# Altium project ESPress_Yourself.PrjPcb
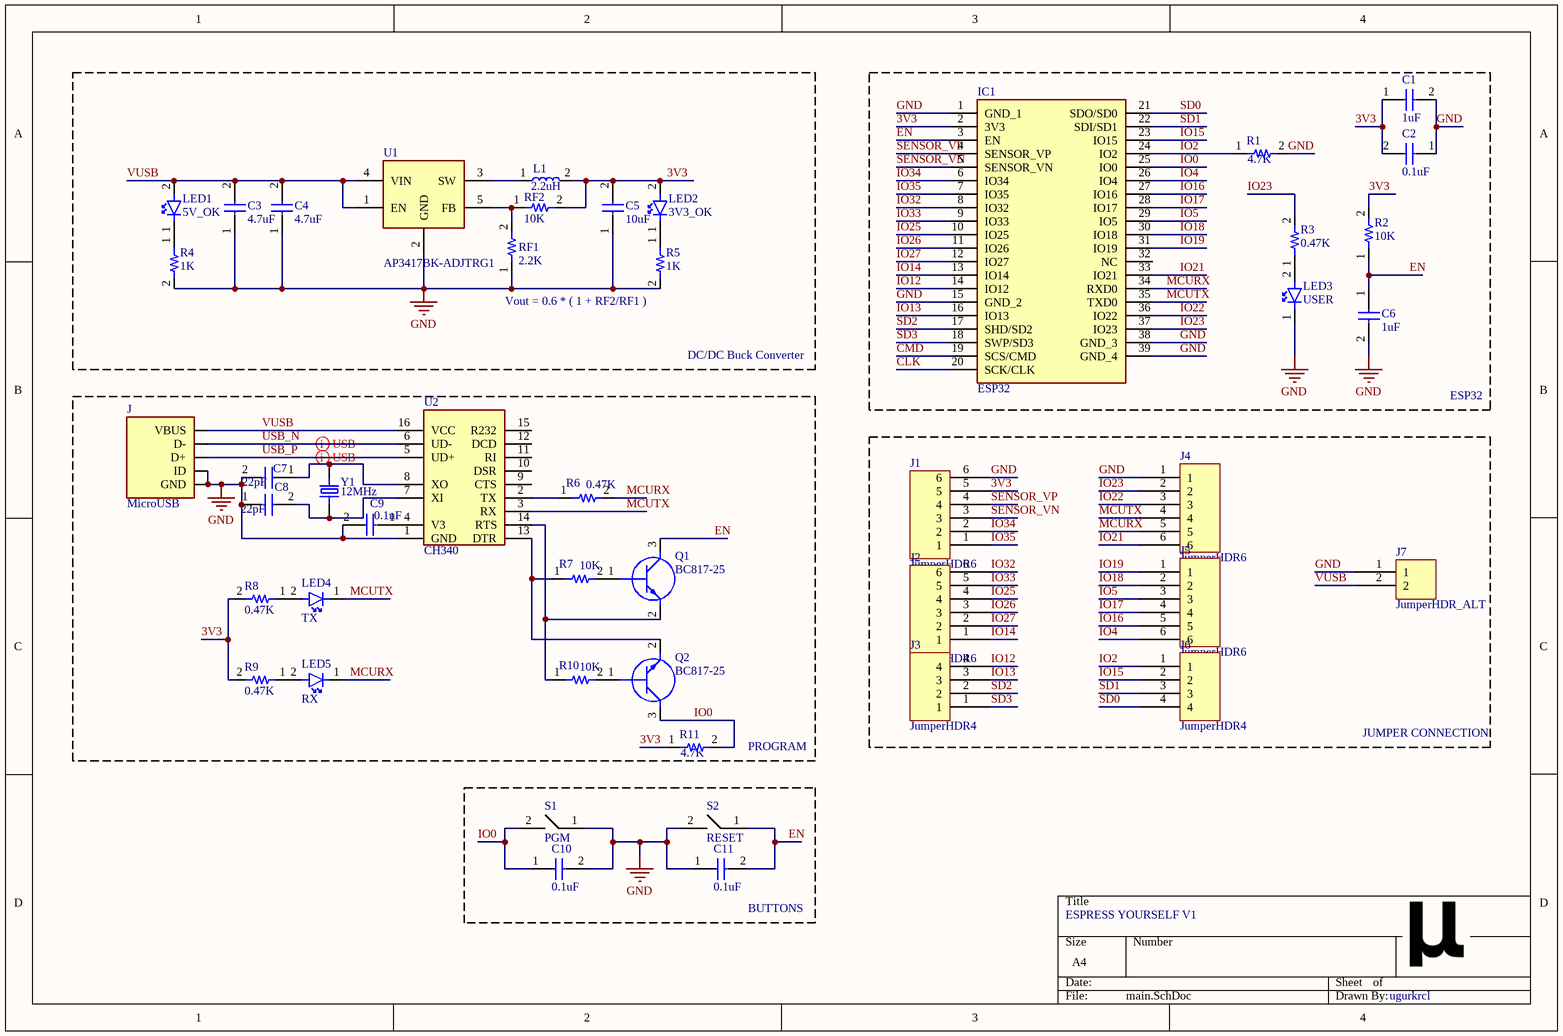
[diagram p0: main.SchDoc]
1 sheet, 46 parts. Net scope: global (net labels, ports and power ports of the same name join across sheets).
Board file: PCB1.PcbDoc

## Sheet main.SchDoc
size A4; SheetNumber: 1; SheetTotal: 1

### Parts
C1  1uF  [0805 Capacitor]
C2  0.1uF  [0603 Capacitor]
C3  4.7uF  [0805 Capacitor]
C4  4.7uF  [0805 Capacitor]
C5  10uF  [0805 Capacitor]
C6  1uF  [0603 Capacitor]
C7  22pF  [0603 Capacitor]
C8  22pF  [0603 Capacitor]
C9  0.1uF  [0603 Capacitor]
C10  0.1uF  [0603 Capacitor]
C11  0.1uF  [0603 Capacitor]
IC1  ESP32  [ESP32]
J  MicroUSB  [MicroUSB]
J1  JumperHDR6  [JumperHDR6]
J2  JumperHDR6  [JumperHDR6]
J3  JumperHDR4  [JumperHDR4]
J4  JumperHDR6  [JumperHDR6]
J5  JumperHDR6  [JumperHDR6]
J6  JumperHDR4  [JumperHDR4]
J7  JumperHDR_ALT  [JumperHDR]
L1  2.2uH  [INDUCTOR_3x3.5]
LED1  5V_OK  [0603 LED]
LED2  3V3_OK  [0603 LED]
LED3  USER  [0603 LED]
LED4  TX  [0603 LED]
LED5  RX  [0603 LED]
Q1  BC817-25  [BC817]
Q2  BC817-25  [BC817]
R1  4.7K  [0603 Resistor]
R2  10K  [0603 Resistor]
R3  0.47K  [0603 Resistor]
R4  1K  [0603 Resistor]
R5  1K  [0603 Resistor]
R6  0.47K  [0603 Resistor]
R7  10K  [0603 Resistor]
R8  0.47K  [0603 Resistor]
R9  0.47K  [0603 Resistor]
R10  10K  [0603 Resistor]
R11  4.7K  [0603 Resistor]
RF1  2.2K  [0603 Resistor]
RF2  10K  [0603 Resistor]
S1  PGM  [TACT SWITCH SMD]
S2  RESET  [TACT SWITCH SMD]
U1  AP3417BK-ADJTRG1  [SOT BUCK]
U2  CH340  [ch340g-SOIC16]
Y1  value 12MHz  [Crystal-HC49]  (hidden comment: HC49 Crystal)

### Blocks framed on the sheet
ESP32: C1 C2 C6 IC1 LED3 R1-R3
PROGRAM: C7-C9 J LED4 LED5 Q1 Q2 R6-R11 U2 Y1
JUMPER CONNECTION: J1-J7
BUTTONS: C10 C11 S1 S2

### Nets
GND: C1.2 C2.1 C3.1 C4.1 C5.1 C6.2 C7.2 C8.1 C9.2 C10.2 C11.1 IC1.1(GND_1) IC1.15(GND_2) IC1.38(GND_3) IC1.39(GND_4) J.4(ID) J.5(GND) J1.6 J4.1 J7.1 LED3.1(K) R1.2 R4.2 R5.2 RF1.1 S1.1 S2.2 U1.2(GND) U2.1(GND)
3V3: C1.1 C2.2 C5.2 IC1.2(3V3) J1.5 L1.2 LED2.2(A) R2.2 R8.2 R9.2 R11.1 RF2.2
CLK: IC1.20(SCK/CLK)
CMD: IC1.19(SCS/CMD)
EN: C6.1 C11.2 IC1.3(EN) Q1.3(C) R2.1 S2.1
IO0: C10.1 IC1.25(IO0) Q2.3(C) R11.2 S1.2
IO2: IC1.24(IO2) J6.1 R1.1
IO4: IC1.26(IO4) J5.6
IO5: IC1.29(IO5) J5.3
IO12: IC1.14(IO12) J3.4
IO13: IC1.16(IO13) J3.3
IO14: IC1.13(IO14) J2.1
IO15: IC1.23(IO15) J6.2
IO16: IC1.27(IO16) J5.5
IO17: IC1.28(IO17) J5.4
IO18: IC1.30(IO18) J5.2
IO19: IC1.31(IO19) J5.1
IO21: IC1.33(IO21) J4.6
IO22: IC1.36(IO22) J4.3
IO23: IC1.37(IO23) J4.2 R3.2
IO25: IC1.10(IO25) J2.4
IO26: IC1.11(IO26) J2.3
IO27: IC1.12(IO27) J2.2
IO32: IC1.8(IO32) J2.6
IO33: IC1.9(IO33) J2.5
IO34: IC1.6(IO34) J1.2
IO35: IC1.7(IO35) J1.1
MCURX: IC1.34(RXD0) J4.5 LED5.1(K) R6.2
MCUTX: IC1.35(TXD0) J4.4 LED4.1(K) U2.3(RX)
SD0: IC1.21(SDO/SD0) J6.4
SD1: IC1.22(SDI/SD1) J6.3
SD2: IC1.17(SHD/SD2) J3.2
SD3: IC1.18(SWP/SD3) J3.1
SENSOR_VN: IC1.5(SENSOR_VN) J1.3
SENSOR_VP: IC1.4(SENSOR_VP) J1.4
USB_N: J.2(D-) U2.6(UD-)
USB_P: J.3(D+) U2.5(UD+)
VUSB: C3.2 C4.2 J.1(VBUS) J7.2 LED1.2(A) U1.1(EN) U1.4(VIN) U2.16(VCC)
NetC7_1: C7.1 U2.8(XO) Y1.2
NetC8_2: C8.2 U2.7(XI) Y1.1
NetC9_1: C9.1 U2.4(V3)
NetL1_1: L1.1 U1.3(SW)
NetLED1_1: LED1.1(K) R4.1
NetLED2_1: LED2.1(K) R5.1
NetLED3_2: LED3.2(A) R3.1
NetLED4_2: LED4.2(A) R8.1
NetLED5_2: LED5.2(A) R9.1
NetQ1_1: Q1.1(B) R7.2
NetQ1_2: Q1.2(E) R10.1 U2.14(RTS)
NetQ2_1: Q2.1(B) R10.2
NetQ2_2: Q2.2(E) R7.1 U2.13(DTR)
NetR6_1: R6.1 U2.2(TX)
NetRF1_2: RF1.2 RF2.1 U1.5(FB)

Not connected (* = marked no-connect by the designer): IC1 32(NC); U2 9(CTS) 10(DSR) 11(RI) 12(DCD) 15(R232)

### Layout directives
differential pair: USB_N, USB_P

### Notes on the sheet
- Vout = 0.6 * ( 1 + RF2/RF1 )
- DC/DC Buck Converter
- ESPRESS YOURSELF V1
- ugurkrcl

### Library data of the parts
C1 C3-C5 = 0805 Capacitor: Capacitor; Manufacturer_Name: TDK; Manufacturer_Part_Number: C3216C0G1H682J060AA; Datasheet Link: https://product.tdk.com/info/en/catalog/datasheets/mlcc_commercial_midvoltage_en.pdf; Height: 0.75mm; Mouser Part Number: 810-C3216C0G1H682J-1; Mouser Price/Stock: https://www.mouser.com/Search/Refine.aspx?Keyword=810-C3216C0G1H682J-1
C2 C6-C11 = 0603 Capacitor: Capacitor; Manufacturer_Name: AVX; Manufacturer_Part_Number: 06031A120JAT2A; Datasheet Link: http://www.mouser.com/catalog/supplier/library/pdf/AVXSurfaceMountCeramic.pdf; Height: 0.9mm; Mouser Part Number: 581-06031A120J; Mouser Price/Stock: https://www.mouser.co.uk/ProductDetail/AVX/06031A120JAT2A?qs=tMrmimOZp5UsY%252BxF6dNGxQ%3D%3D; Arrow Part Number: 06031A120JAT2A; Arrow Price/Stock: https://www.arrow.com/en/products/06031a120jat2a/avx
IC1 = ESP32: Integrated Circuit; Manufacturer_Name: Espressif Systems; Manufacturer_Part_Number: ESP-WROOM-32D; Datasheet Link: https://componentsearchengine.com/Datasheets/1/ESP-WROOM-32D.pdf; Height: 3.2mm; Mouser Part Number: 356-ESP-WROOM-32D; Mouser Price/Stock: https://www.mouser.co.uk/ProductDetail/Espressif-Systems/ESP-WROOM-32D?qs=MLItCLRbWsyWVKgdQMcFuQ%3D%3D
J = MicroUSB: MP: ZX62-B-5PA; MF: Hirose; Value: *; Price: None; SnapEDA_Link: https://www.snapeda.com/parts/ZX62-B-5PA/Hirose%20Electric%20Co%20Ltd/view-part/134668/?ref=snap; Availability: Unavailable; Package: None
L1 = INDUCTOR_3x3.5: Inductor; Manufacturer_Name: Shuo Xing; Manufacturer_Part_Number: CD32-4R7M; Datasheet Link: http://aitendo3.sakura.ne.jp/aitendo_data/product_img/parts/coil/CD32/CD32.pdf; Height: 2.4mm
LED1-LED5 = 0603 LED: LED; Manufacturer_Name: Wurth Elektronik; Manufacturer_Part_Number: 150060GS55040; Datasheet Link: https://katalog.we-online.de/led/datasheet/150060GS55040.pdf; Height: 0.5mm; Mouser Part Number: 710-150060GS55040; Mouser Price/Stock: https://www.mouser.com/Search/Refine.aspx?Keyword=710-150060GS55040
Q1 Q2 = BC817-25: Transistor BJT NPN; Manufacturer_Name: Nexperia; Datasheet Link: https://assets.nexperia.com/documents/data-sheet/BC817_BC817W_BC337.pdf; Height: 1.1mm; Manufacturer_Part_Number: BC817-25; Mouser Part Number: N/A; Mouser Price/Stock: https://www.mouser.com/Search/Refine.aspx?Keyword=N%2FA
R1-R11 RF1 RF2 = 0603 Resistor: Resistor; Manufacturer_Name: TE Connectivity; Manufacturer_Part_Number: CPF0603B100RE1; Datasheet Link: http://www.farnell.com/datasheets/1786775.pdf; Height: 0.55mm; Mouser Part Number: 279-CPF0603B100RE1; Mouser Price/Stock: https://www.mouser.co.uk/ProductDetail/TE-Connectivity-Neohm/CPF0603B100RE1?qs=DfH2yQaBz6s2KWheq2AlNw%3D%3D; Arrow Part Number: CPF0603B100RE1; Arrow Price/Stock: https://www.arrow.com/en/products/cpf0603b100re1/te-connectivity
S1 S2 = TACT SWITCH SMD: MP: B3F-1000; MF: Omron; Price: None; Package: None; Value: *; Availability: Unavailable; SnapEDA_Link: https://www.snapeda.com/parts/B3F-1000/Omron%20Electronics%20Inc-EMC%20Div/view-part/48569/?ref=snap
U1 = AP3417BK-ADJTRG1: Power Supply; Manufacturer_Name: Diodes Inc.; Datasheet Link: https://www.diodes.com/assets/Datasheets/AP3417B.pdf; Height: 1.45mm; Manufacturer_Part_Number: AP3417BK-ADJTRG1; Mouser Part Number: 621-AP3417BK-ADJTRG1; Mouser Price/Stock: https://www.mouser.com/Search/Refine.aspx?Keyword=621-AP3417BK-ADJTRG1; Arrow Part Number: AP3417BK-ADJTRG1; Arrow Price/Stock: https://www.arrow.com/en/products/ap3417bk-adjtrg1/diodes-incorporated
U2 = CH340: MF: Eaton; Availability: Unavailable; Price: None; Package: None; Value: *; SnapEDA_Link: https://www.snapeda.com/parts/CH340/Eaton/view-part/4701946/?ref=snap; MP: CH340
Y1 = HC49 Crystal: MF: ECS Inc.; MP: ECS-80-18-4XDN; Digi-Key_Part_Number: X1115-ND; Package: HC-49/US ECS International; SnapEDA_Link: https://www.snapeda.com/parts/ECS-80-18-4XDN/ECS%20Inc./view-part/49558/?ref=snap; Digi-Key_Purchase_URL: https://www.digikey.in/product-detail/en/ecs-inc/ECS-80-18-4XDN/X1115-ND/827606?utm_source=snapeda&utm_medium=aggregator&utm_campaign=symbol